# Altium schematic sheet Circuit.SchDoc
size Letter; SheetNumber: 1; SheetTotal: 3
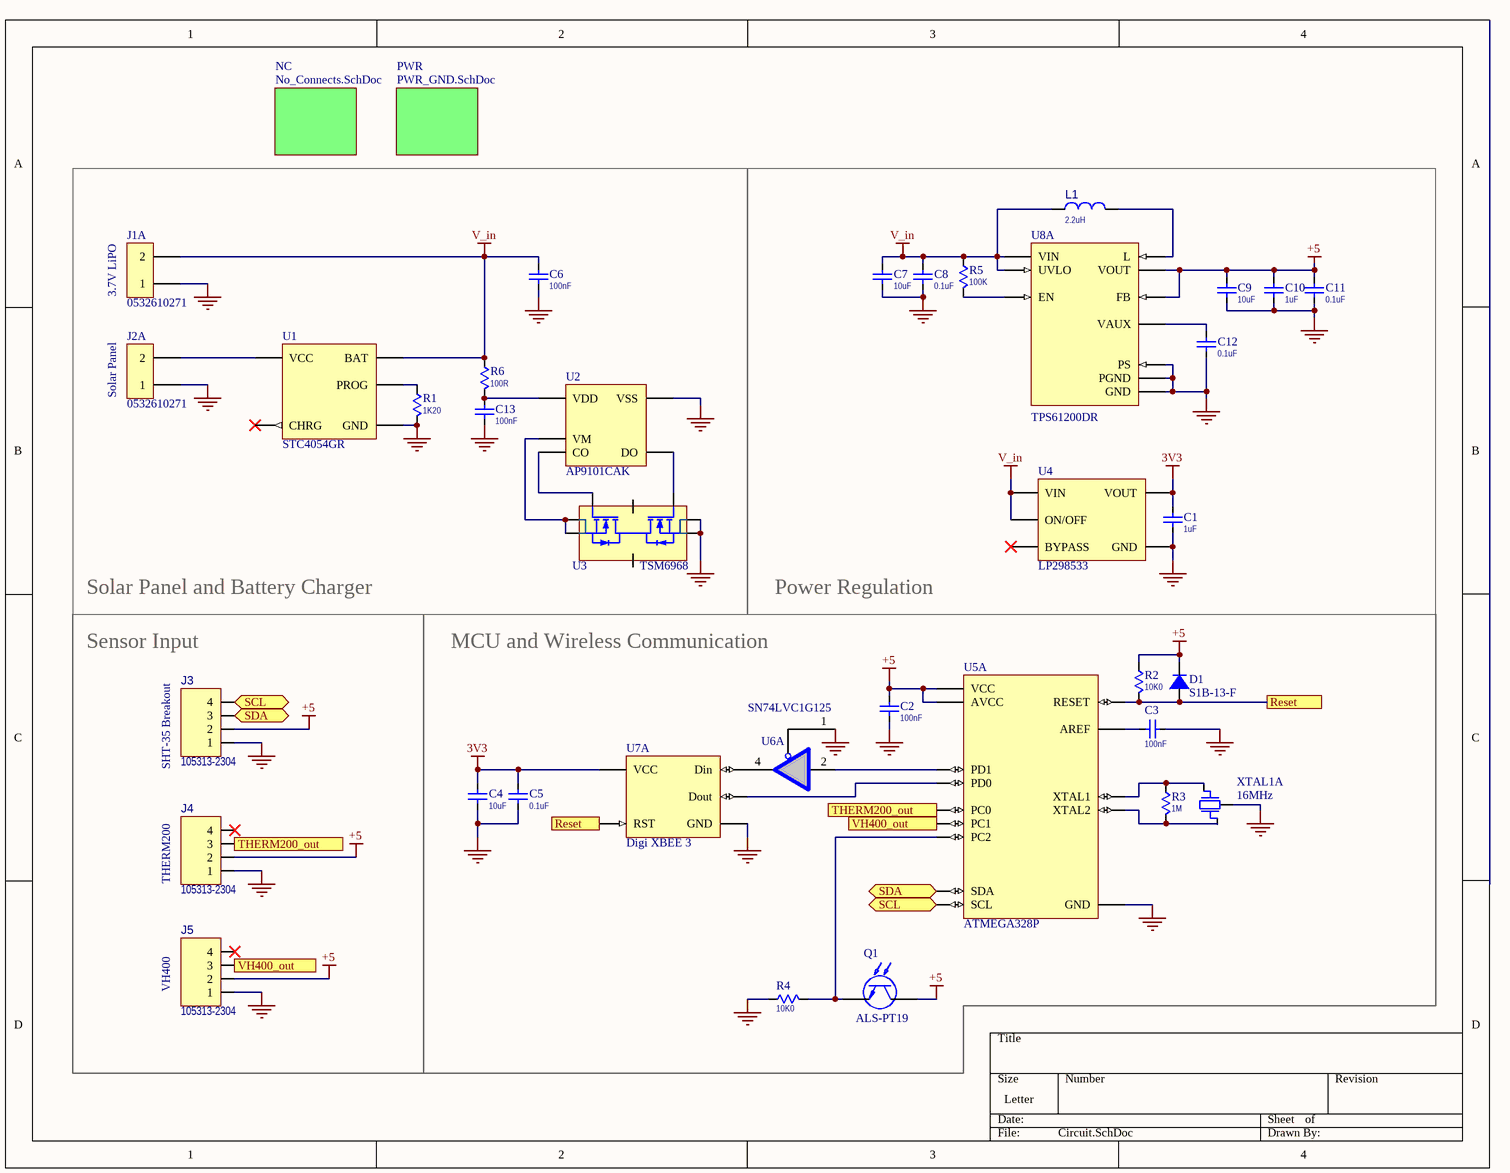
[diagram p0: Circuit.SchDoc]

## Parts
C1  value 1uF  [CAP0603_HD]  (hidden comment: CAP_1.0uF_50V_10%_X7R_0603(1608M))
C2  value 100nF  [CAP0603_HD]  (hidden comment: CAP_100nF_100V_10%_X7R_0603(1608M))
C3  value 100nF  [CAP0603_HD]  (hidden comment: CAP_100nF_100V_10%_X7R_0603(1608M))
C4  value 10uF  [CAP0603_HD]  (hidden comment: CAP_10uF_10V_15%_X5R_0603(1608M))
C5  value 0.1uF  [CAP0402_HD]  (hidden comment: CAP_0.1uF_25V_10%_X7R_0402(1005M))
C6  value 100nF  [CAP0603_HD]  (hidden comment: CAP_100nF_100V_10%_X7R_0603(1608M))
C7  value 10uF  [CAP0603_HD]  (hidden comment: CAP_10uF_10V_15%_X5R_0603(1608M))
C8  value 0.1uF  [CAP0402_HD]  (hidden comment: CAP_0.1uF_25V_10%_X7R_0402(1005M))
C9  value 10uF  [CAP0603_HD]  (hidden comment: CAP_10uF_10V_15%_X5R_0603(1608M))
C10  value 1uF  [CAP0603_HD]  (hidden comment: CAP_1.0uF_50V_10%_X7R_0603(1608M))
C11  value 0.1uF  [CAP0402_HD]  (hidden comment: CAP_0.1uF_25V_10%_X7R_0402(1005M))
C12  value 0.1uF  [CAP0402_HD]  (hidden comment: CAP_0.1uF_25V_10%_X7R_0402(1005M))
C13  value 100nF  [CAP0603_HD]  (hidden comment: CAP_100nF_100V_10%_X7R_0603(1608M))
D1  Part Number: S1B-13-F  [SMA_DIODE]  (hidden comment: Diode_S1B-13-F)
J1  0532610271  [MOLEX_53261-0271]  (part A of 2)
J2  0532610271  [MOLEX_53261-0271]  (part A of 2)
J3  Manf P/N: 105313-2304  [CON_105313-2304]  (hidden comment: CON_105313-2304)
J4  Manf P/N: 105313-2304  [CON_105313-2304]  (hidden comment: CON_105313-2304)
J5  Manf P/N: 105313-2304  [CON_105313-2304]  (hidden comment: CON_105313-2304)
L1  value 2.2uH  [IND_1616]  (hidden comment: IND_2.2uH_WireWound)
Q1  Pat Number: ALS-PT19  [ALS-PT19 Phototransistor]  (hidden comment: ALS-PT19 Phototransistor)
R1  value 1K20  [RES_0603_HD]  (hidden comment: RES_1.2K_0.1%_0.1W_0603)
R2  value 10K0  [RES_0603_HD]  (hidden comment: RES_10.0K_1%_0.33W_0603)
R3  value 1M  [RES_0603_HD]  (hidden comment: RES_1.00M_0.1%_0.1W_0603)
R4  value 10K0  [RES_0603_HD]  (hidden comment: RES_10.0K_1%_0.33W_0603)
R5  value 100K  [RES_0603_HD]  (hidden comment: RES_100K_0.1%_0.1W_0603)
R6  100R  [RES_0603_HD]
U1  STC4054GR  [TSOT-23-5]
U2  Part Number: AP9101CAK  [SOT-25]  (hidden comment: AP9101CAK-ABTRG1)
U3  Parameter 1: TSM6968  [8-TSSOP]  (hidden comment: TSM6968DCA)
U4  Part Number: LP298533  [SOT23-5]  (hidden comment: LP298533DBVR Voltage Regulator)
U5  Part Number: ATMEGA328P  [32A_ATM]  (hidden comment: ATMEGA328P_SMD)  (part A of 4)
U6  Part Number: SN74LVC1G125  [SOT-SC70-5]  (hidden comment: SN74LVC1G125DCKR)  (part A of 3)
U7  Part Number: Digi XBEE 3  [XBee_1W_Base]  (hidden comment: XBEE 3 SMD)  (part A of 3)
U8  Part Number: TPS61200DR  [10-VFDFN Exposed Pad]  (hidden comment: TPS61200DR Voltage Boost Regulator)  (part A of 2)
XTAL1  value 16MHz  [OSC SMD-4]  (hidden comment: CX3225SB16000D0GZJC1)  (part A of 2)

## Blocks framed on the sheet
Solar Panel and Battery Charger: C6 C13 J1 J2 R1 R6 U1-U3
Power Regulation: C1 C7-C12 L1 R5 U4 U8

## Sub-sheets
NC = No_Connects.SchDoc: no entries
PWR = PWR_GND.SchDoc: no entries

## Ports
Reset, SCL (bidir), SDA (bidir), THERM200_out (in), THERM200_out (out), VH400_out (in), VH400_out (out)

## Nets
3V3: C1.1 C4.1 C5.1 U4.5(VOUT) U7.2(VCC)
+5: C2.1 C9.1 C10.1 C11.1 D1.1 J3.2 J4.2 J5.2 Q1.2 R2.1 U5.4(VCC) U5.18(AVCC) U8.2(VOUT) U8.10(FB)
GND: C1.2 C2.2 C3.2 C4.2 C5.2 C6.2 C7.2 C8.2 C9.2 C10.2 C11.2 C12.2 C13.2 J1.1 J2.1 J3.1 J4.1 J5.1 R1.2 R4.1 U1.2(GND) U2.3(VSS) U3.6(S2) U3.7(S2) U4.2(GND) U5.5(GND) U6.1(OE) U7.13(GND) U8.4(PGND) U8.8(PS) U8.11(GND) XTAL1.2(GND)
V_in: C6.1 C7.1 C8.1 J1.2 L1.1 R5.1 R6.1 U1.3(BAT) U4.1(VIN) U4.3(ON/OFF) U8.5(VIN) U8.7(UVLO)
Reset: D1.2 R2.2 U5.29(RESET) U7.6(RST) ; port Reset
SCL: J3.4 U5.28(SCL) ; port SCL
SDA: J3.3 U5.27(SDA) ; port SDA
THERM200_out: J4.3 U5.23(PC0) ; port THERM200_out
VH400_out: J5.3 U5.24(PC1) ; port VH400_out
NetC3_1: C3.1 U5.20(AREF)
NetC12_1: C12.1 U8.1(VAUX)
NetC13_1: C13.1 R6.2 U2.2(VDD)
NetJ2_2: J2.2 U1.4(VCC)
NetL1_2: L1.2 U8.3(L)
NetQ1_1: Q1.1 R4.2 U5.25(PC2)
NetR1_1: R1.1 U1.5(PROG)
NetR3_1: R3.1 U5.8(XTAL1) XTAL1.1(HOT)
NetR3_2: R3.2 U5.7(XTAL2) XTAL1.3(HOT)
NetR5_2: R5.2 U8.6(EN)
NetU2_1: U2.1(VM) U3.2(S1) U3.3(S1)
NetU2_4: U2.4(DO) U3.5(G2)
NetU2_5: U2.5(CO) U3.4(G1)
NetU5_30: U5.30(PD0) U7.3(Dout)
NetU5_31: U5.31(PD1) U6.2(A)
NetU6_4: U6.4(Y) U7.4(Din)

Not connected (* = marked no-connect by the designer): J4 4*; J5 4*; U1 1(CHRG)*; U3 1(D2) 8(D1); U4 4(BYPASS)*

## Notes on the sheet
- (near J1) 3.7V LiPO
- (near J2) Solar Panel
- (near J3) Sensor Input
- MCU and Wireless Communication
- (near J3) SHT-35 Breakout
- (near J4) THERM200
- (near J5) VH400

## Library data of the parts
C1 C10 = CAP_1.0uF_50V_10%_X7R_0603(1608M): CAP, 1.0uF, 50V, 10%, X7R, 0603(1608M); MANF: Taiyo Yuden; MANF P/N: UMK107AB7105KA-T; Temperature Characteristics: X7R; Tolerance: 10%; Supplier 1: Digi-Key; Supplier Part Number 1: 587-3247-1-ND; Supplier 2: Mouser; Supplier Part Number 2: 963-UMK107AB7105KA-T; Voltage: 50V
C2 C3 C6 C13 = CAP_100nF_100V_10%_X7R_0603(1608M): CAP, 100nF, 100V, 10%, X7R, 0603(1608M); MANF: Murata; MANF P/N: GCJ188R72A104KA01D; ALT MANF: AVX; ALT MANF P/N: 06031C104KAT2A; Temperature Characteristics: X7R; Tolerance: 10%; Voltage: 100V
C4 C7 C9 = CAP_10uF_10V_15%_X5R_0603(1608M): CAP, 10uF, 10V, 15%, X5R, 0603(1608M); MANF: Murata; MANF P/N: GRM188R61A106KE69D; Temperature Characteristics: X5R; Tolerance: 15%; Supplier 1: Digi-Key; Supplier 2: Mouser; Supplier Part Number 2: 81-GRM188R61A106KE9D; Supplier Part Number 1: 490-10474-2-ND
C5 C8 C11 C12 = CAP_0.1uF_25V_10%_X7R_0402(1005M): CAP, 0.1uF, 25V, 10%, X7R, 0402(1005M); MANF: Samsung; MANF P/N: CL05B104KA5NNNC; Temperature Characteristics: X7R; Tolerance: 10%; Supplier 1: Digi-Key; Supplier Part Number 1: 1276-6720-2-ND; Voltage: 25V
J1 J2 = 0532610271: 2 Pos Molex Microblade; Supplier 1: Digi-Key; Supplier Part Number 1: WM7620CT-ND; Part Number: 0532610271
J3-J5 = CON_105313-2304: Connector, 2.5MM, 4 pos Singlel Row Header - Right Angle; Manf: Molex
L1 = IND_2.2uH_WireWound: Inductor SMT, 27nH, Wire-wound Ceramic, 0402HP; MANF: COILCRAFT; MANF P/N: 0402HP-27NXJLU; Supplier 1: Mouser; Supplier 2: Farnell; Supplier Part Number 1: 994-0402HP-27NXJLU; Supplier Part Number 2: 2285846; INDUSTRY_STD_PKG_TYPE: 0402HP
R1 = RES_1.2K_0.1%_0.1W_0603: Tolerance: 1%; Power: 0.05W; MANF: PANASONIC; MANF P/N: ERJ-1GNF1201C; Supplier 1: Digi-Key; Supplier Part Number 1: P1.2KDBCT-ND
R2 R4 = RES_10.0K_1%_0.33W_0603: Tolerance: 1%; Power: 0.33W; MANF: Vishay/Dale; MANF P/N: CRCW060310K0FKEAHP; ALT MANF: KOA Speer; ALT MANF P/N: SG73P1JTTD1002F; Supplier 1: Digi-Key; Supplier Part Number 1: 541-10.0KSCT-ND
R3 = RES_1.00M_0.1%_0.1W_0603: Tolerance: 1%; Power: 0.05W; MANF: PANASONIC; MANF P/N: ERJ-1GNF1004C; Supplier 1: Digi-Key; Supplier Part Number 1: YAG4498CT-ND
R5 = RES_100K_0.1%_0.1W_0603: Tolerance: 1%; Power: 0.05W; MANF: PANASONIC; MANF P/N: ERJ-1GNF1203C; Supplier 1: Digi-Key; Supplier Part Number 1: P122695CT-ND
R6 = RES_100_0.5%_1/16W_0603: Tolerance: 1%; MANF: Vishay; MANF P/N: CRCW020115K0FKED; Power: 0.05W; Supplier 1: Digi-Key; Supplier Part Number 1: RR08P100DCT-ND; Value: 100R
U1 = STC4054GR: 800mA Standalone linear Li-ion charger with thermal regulation; Supplier 1: Digi-Key; Supplier Part Number 1: 497-5809-1-ND; Part Number: STC4054GR
U2 = AP9101CAK-ABTRG1: Battery Protection IC for LiPo; Supplier 1: Digi-Key; Supplier Part Number 1: AP9101CAK-ABTRG1DICT-ND
U4 = LP298533DBVR Voltage Regulator: Arduino 3.3v regulator; Supplier 1: Digi-Key; Supplier Part Number 1: 296-24263-1-ND
U5 = ATMEGA328P_SMD: Arduino ATMEGA328 Chip; Supplier 1: Digi-Key; Supplier Part Number 1: ATMEGA328P-AURCT-ND
U6 = SN74LVC1G125DCKR: Single Bus 3-State Buffer; Supplier 1: Digi-Key; Supplier Part Number 1: 296-11603-1-ND
U8 = TPS61200DR Voltage Boost Regulator: Used on Pololu step up regulator board; Supplier 1: Digi-Key; Supplier Part Number 1: 296-21663-1-ND
XTAL1 = CX3225SB16000D0GZJC1: 16MHz Oscillator; Supplier 1: Digi-Key; Supplier Part Number 1: 1253-1698-1-ND
D1 = Diode_S1B-13-F: Supplier 1: Digi-Key; Supplier Part Number 1: S1B-FDICT-ND
Q1 = ALS-PT19 Phototransistor: Supplier 1: Digi-Key; Supplier Part Number 1: 1080-1244-1-ND
U3 = TSM6968DCA: Supplier 1: Digi-Key; Supplier Part Number 1: TSM6968DCARVGCT-ND
U7 = XBEE 3 SMD: Supplier 1: Digi-Key; Supplier Part Number 1: 602-2200-ND